# Altium schematic sheet BSPD.SchDoc
size A
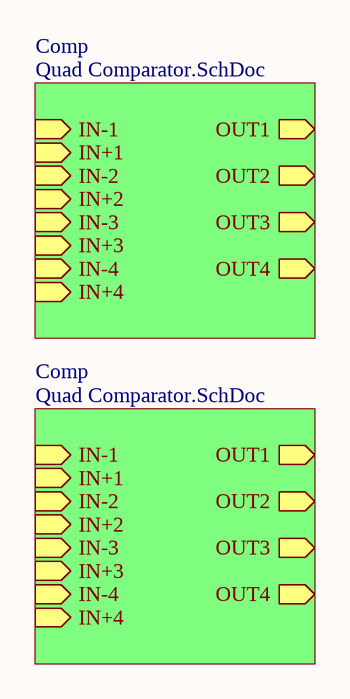
[diagram p0: BSPD.SchDoc]

## Sub-sheets
Comp = Quad Comparator.SchDoc: IN+3 (in), IN+4 (in), IN-3 (in), OUT2 (out), IN-2 (in), IN+1 (in), IN-1 (in), OUT1 (out), OUT4 (out), IN-4 (in), IN+2 (in), OUT3 (out)
Comp = Quad Comparator.SchDoc: IN+3 (in), IN+4 (in), IN-3 (in), OUT2 (out), IN-2 (in), IN+1 (in), IN-1 (in), OUT1 (out), OUT4 (out), IN-4 (in), IN+2 (in), OUT3 (out)